# Altium schematic sheet psu.SchDoc: Power Supplies
size A2; DrawnBy: Stefan Lippuner; Organization: TIK; DocumentNumber: 3; Revision: 1; SheetNumber: 3; SheetTotal: 8
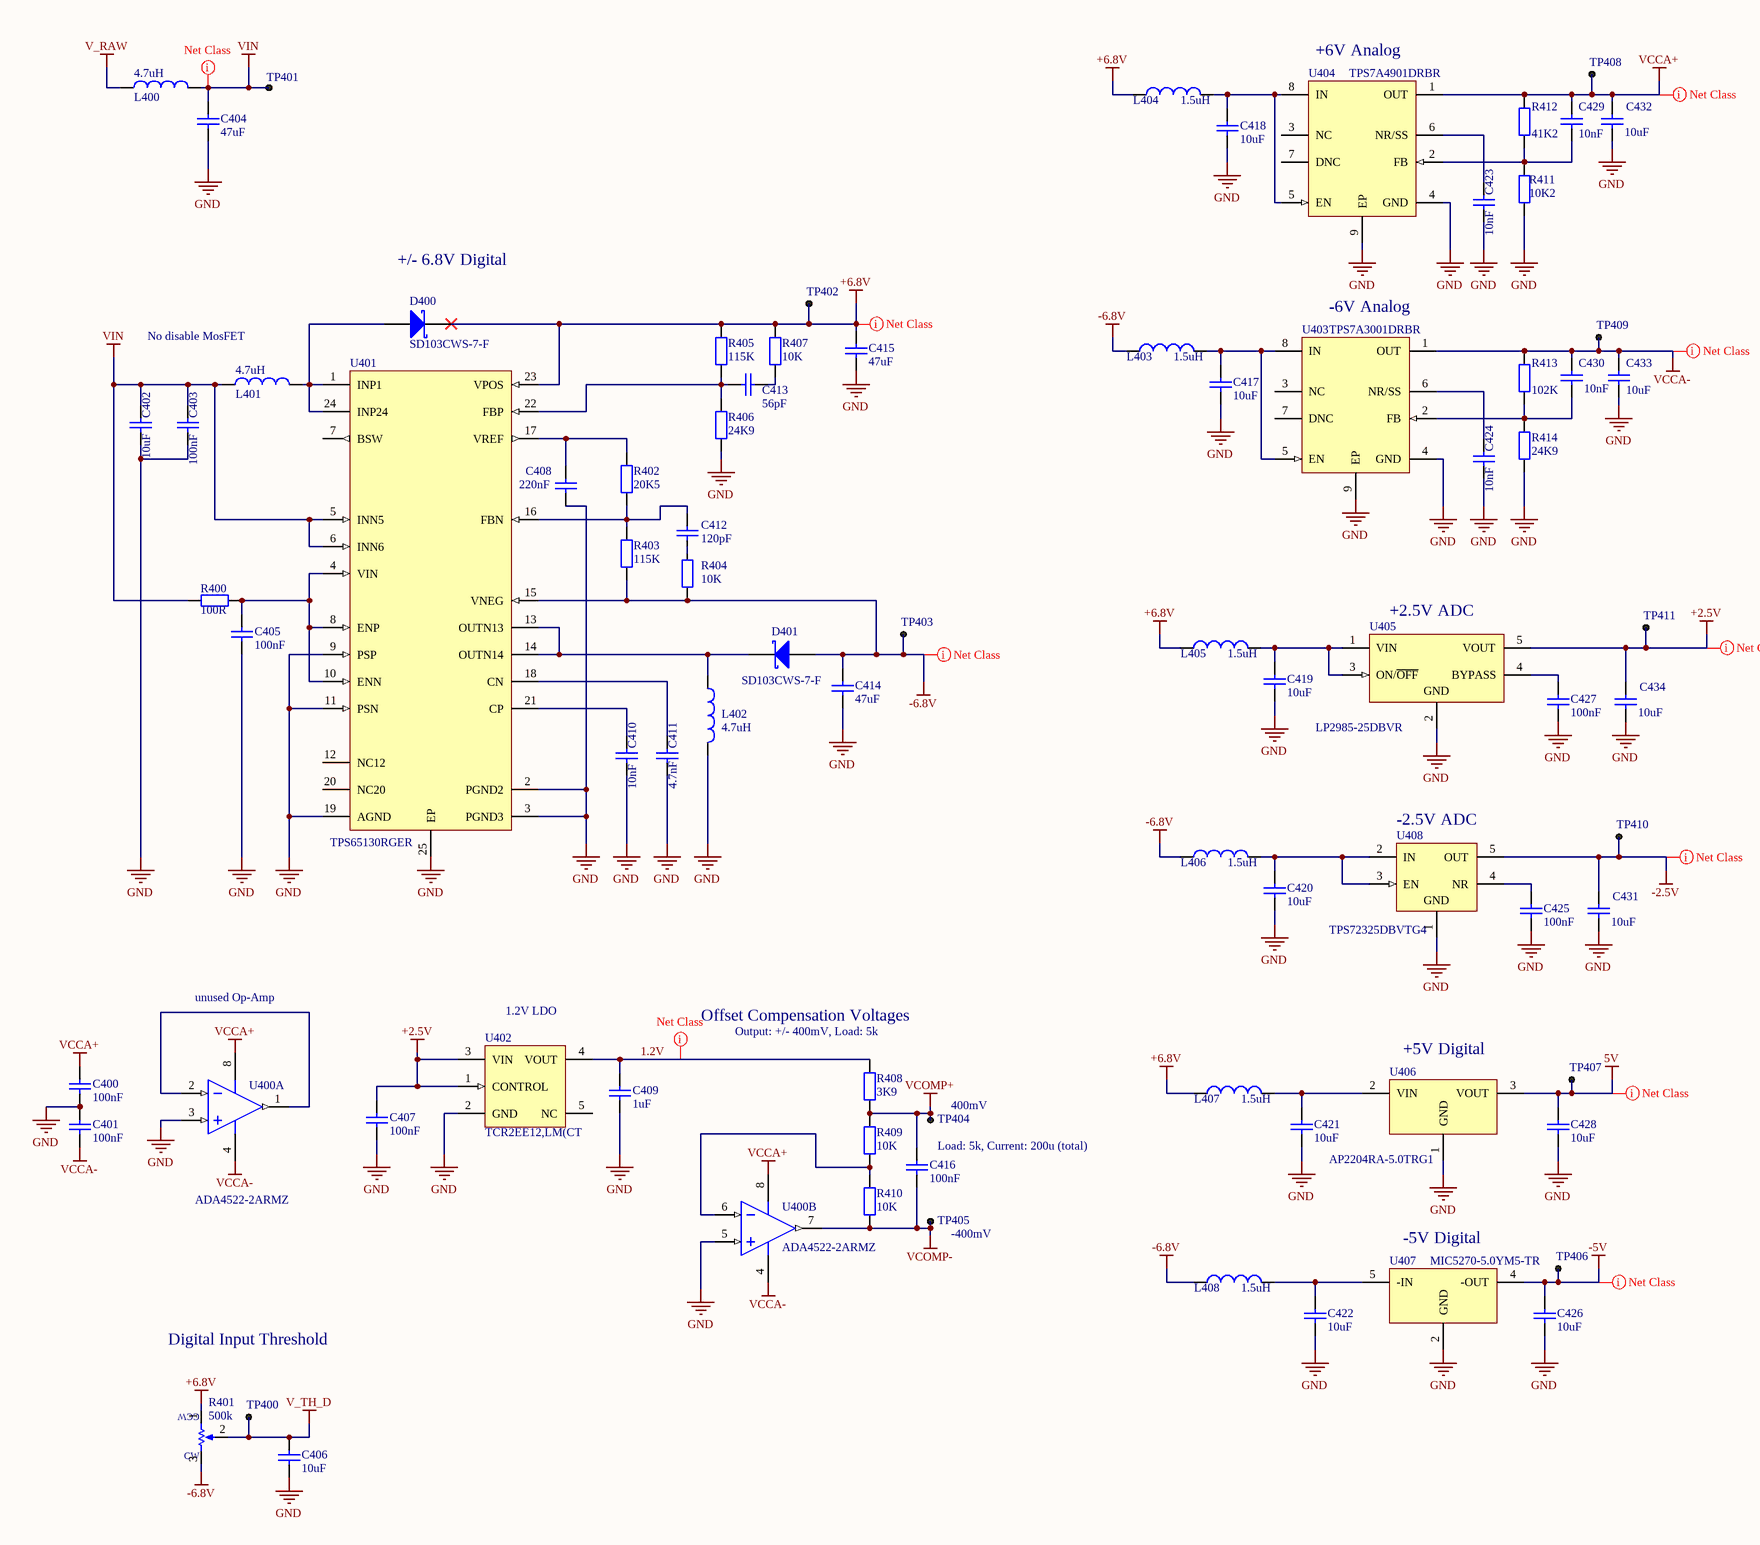
[diagram p0: psu.SchDoc]

## Parts
C400  100nF  [CAPC0402(1005)60_L]
C401  100nF  [CAPC0402(1005)60_L]
C402  10uF  [CAPC0603(1608)100_L]
C403  100nF  [CAPC0402(1005)60_L]
C404  47uF  [CAPC1210(3225)280_L]
C405  100nF  [CAPC0402(1005)60_L]
C406  10uF  [CAPC0603(1608)100_L]
C407  100nF  [CAPC0402(1005)60_L]
C408  220nF  [CAPC0402(1005)60_L]
C409  1uF  [CAPC0402(1005)60_L]
C410  10nF  [CAPC0402(1005)60_L]
C411  4.7nF  [CAPC0402(1005)60_L]
C412  120pF  [CAPC0402(1005)60_L]
C413  56pF  [CAPC0402(1005)60_L]
C414  47uF  [CAPC1210(3225)280_L]
C415  47uF  [CAPC1210(3225)280_L]
C416  100nF  [CAPC0402(1005)60_L]
C417  10uF  [CAPC0603(1608)100_L]
C418  10uF  [CAPC0603(1608)100_L]
C419  10uF  [CAPC0603(1608)100_L]
C420  10uF  [CAPC0603(1608)100_L]
C421  10uF  [CAPC0603(1608)100_L]
C422  10uF  [CAPC0603(1608)100_L]
C423  10nF  [CAPC0402(1005)60_L]
C424  10nF  [CAPC0402(1005)60_L]
C425  100nF  [CAPC0402(1005)60_L]
C426  10uF  [CAPC0603(1608)100_L]
C427  100nF  [CAPC0402(1005)60_L]
C428  10uF  [CAPC0603(1608)100_L]
C429  10nF  [CAPC0402(1005)60_L]
C430  10nF  [CAPC0402(1005)60_L]
C431  10uF  [CAPC0603(1608)100_L]
C432  10uF  [CAPC0603(1608)100_L]
C433  10uF  [CAPC0603(1608)100_L]
C434  10uF  [CAPC0603(1608)100_L]
D400  SD103CWS-7-F  [DIOD-SOD323-2_V]
D401  SD103CWS-7-F  [DIOD-SOD323-2_V]
L400  4.7uH  [INDC2520X10L]
L401  4.7uH  [INDC2520X10L]
L402  4.7uH  [INDC2520X10L]
L403  1.5uH  [INDC0603(1608)_L]
L404  1.5uH  [INDC0603(1608)_L]
L405  1.5uH  [INDC0603(1608)_L]
L406  1.5uH  [INDC0603(1608)_L]
L407  1.5uH  [INDC0603(1608)_L]
L408  1.5uH  [INDC0603(1608)_L]
R400  100R  [RESC0402(1005)_L]
R401  value 500k  [43W]  (hidden comment: 43WR500KLFTR)
R402  20K5  [RESC0402(1005)_L]
R403  115K  [RESC0402(1005)_L]
R404  10K  [RESC0402(1005)_L]
R405  115K  [RESC0402(1005)_L]
R406  24K9  [RESC0402(1005)_L]
R407  10K  [RESC0402(1005)_L]
R408  3K9  [RESC0402(1005)_L]
R409  10K  [RESC0402(1005)_L]
R410  10K  [RESC0402(1005)_L]
R411  10K2  [RESC0402(1005)_L]
R412  41K2  [RESC0402(1005)_L]
R413  102K  [RESC0402(1005)_L]
R414  24K9  [RESC0402(1005)_L]
TP400  (no value)  [Pad-0.6mm]  (no BOM)
TP401  (no value)  [Pad-0.6mm]  (no BOM)
TP402  (no value)  [Pad-0.6mm]  (no BOM)
TP403  (no value)  [Pad-0.6mm]  (no BOM)
TP404  (no value)  [Pad-0.6mm]  (no BOM)
TP405  (no value)  [Pad-0.6mm]  (no BOM)
TP406  (no value)  [Pad-0.6mm]  (no BOM)
TP407  (no value)  [Pad-0.6mm]  (no BOM)
TP408  (no value)  [Pad-0.6mm]  (no BOM)
TP409  (no value)  [Pad-0.6mm]  (no BOM)
TP410  (no value)  [Pad-0.6mm]  (no BOM)
TP411  (no value)  [Pad-0.6mm]  (no BOM)
U400  ADA4522-2ARMZ  [ADI-RM-8_L]  (parts A,B of 2)
U401  TPS65130RGER  [LT-UF-24_L]
U402  TCR2EE12,LM(CT  [TI-DRL5_L]
U403  TPS7A3001DRBR  [DRB8-1750X1500TP]
U404  TPS7A4901DRBR  [DRB8-1750X1500TP]
U405  LP2985-25DBVR  [DBV0005A_L]
U406  AP2204RA-5.0TRG1  [SOT89_L]
U407  MIC5270-5.0YM5-TR  [Z5+1_L]
U408  TPS72325DBVTG4  [TI-DBV5_L]

## Nets
5V: C428.2 TP407.1 U406.3(VOUT)
+2.5V: C407.2 C434.2 TP411.1 U402.1(CONTROL) U402.3(VIN) U405.5(VOUT)
+6.8V: C415.1 D400.2(K) L404.1 L405.1 L407.1 R401.1(CCW) R405.2 R407.2 TP402.1 U401.23(VPOS)
-2.5V: C431.2 TP410.1 U408.5(OUT)
-5V: C426.2 TP406.1 U407.4(-OUT)
-6.8V: C414.1 D401.1(A) L403.1 L406.1 L408.1 R401.3(CW) R403.2 R404.1 TP403.1 U401.15(VNEG)
GND: C400.1 C401.2 C402.1 C403.1 C404.2 C405.1 C406.1 C407.1 C408.1 C409.1 C410.1 C411.1 C414.2 C415.2 C417.1 C418.1 C419.1 C420.1 C421.1 C422.1 C423.1 C424.1 C425.1 C426.1 C427.1 C428.1 C431.1 C432.1 C433.1 C434.1 L402.2 R406.1 R411.1 R414.1 U400.3(1IN+) U400.5(2IN+) U401.2(PGND2) U401.3(PGND3) U401.9(PSP) U401.11(PSN) U401.19(AGND) U401.25(EP) U402.2(GND) U403.4(GND) U403.9(EP) U404.4(GND) U404.9(EP) U405.2(GND) U406.1(GND) U407.2(GND) U408.1(GND)
V_RAW: L400.1
V_TH_D: C406.2 R401.2(WIPER) TP400.1
VCCA+: C400.2 C429.2 C432.2 R412.2 TP408.1 U400.8(V+) U404.1(OUT)
VCCA-: C401.1 C430.2 C433.2 R413.2 TP409.1 U400.4(V-) U403.1(OUT)
VCOMP+: C416.2 R408.1 R409.2 TP404.1
VCOMP-: C416.1 R410.1 TP405.1 U400.7(2OUT)
VIN: C402.2 C403.2 C404.1 L400.2 L401.1 R400.2 TP401.1 U401.5(INN5) U401.6(INN6)
1.2V: C409.2 R408.2 U402.4(VOUT)
NetC405_2: C405.2 R400.1 U401.4(VIN) U401.8(ENP) U401.10(ENN)
NetC408_2: C408.2 R402.2 U401.17(VREF)
NetC410_2: C410.2 U401.21(CP)
NetC411_2: C411.2 U401.18(CN)
NetC412_1: C412.1 R404.2
NetC412_2: C412.2 R402.1 R403.1 U401.16(FBN)
NetC413_1: C413.1 R407.1
NetC413_2: C413.2 R405.1 R406.2 U401.22(FBP)
NetC417_2: C417.2 L403.2 U403.5(EN) U403.8(IN)
NetC418_2: C418.2 L404.2 U404.5(EN) U404.8(IN)
NetC419_2: C419.2 L405.2 U405.1(VIN) U405.3(ON/~{OFF})
NetC420_2: C420.2 L406.2 U408.2(IN) U408.3(EN)
NetC421_2: C421.2 L407.2 U406.2(VIN)
NetC422_2: C422.2 L408.2 U407.5(-IN)
NetC423_2: C423.2 U404.6(NR/SS)
NetC424_2: C424.2 U403.6(NR/SS)
NetC425_2: C425.2 U408.4(NR)
NetC427_2: C427.2 U405.4(BYPASS)
NetC429_1: C429.1 R411.2 R412.1 U404.2(FB)
NetC430_1: C430.1 R413.1 R414.2 U403.2(FB)
NetD400_1: D400.1(A) L401.2 U401.1(INP1) U401.24(INP24)
NetD401_2: D401.2(K) L402.1 U401.13(OUTN13) U401.14(OUTN14)
NetR409_1: R409.1 R410.2 U400.6(2IN-)
NetU400_1: U400.1(1OUT) U400.2(1IN-)

Not connected (* = marked no-connect by the designer): U401 7(BSW) 12(NC12) 20(NC20); U402 5(NC); U403 3(NC) 7(DNC); U404 3(NC) 7(DNC)

## Layout directives
net class Power: 1.2V, 5V, +2.5V, +6.8V, -2.5V, -5V, -6.8V, VCCA+, VCCA-, VIN

## Notes on the sheet
- (near U404) +6V Analog
- +/- 6.8V Digital
- (near L401) No disable MosFET
- (near U403) -6V Analog
- (near U405) +2.5V ADC
- (near U408) -2.5V ADC
- unused Op-Amp
- (near U402) 1.2V LDO
- (near R408) Offset Compensation Voltages
- (near R408) Output: +/- 400mV, Load: 5k
- (near U406) +5V Digital
- Load: 5k, Current: 200u (total)
- (near TP404) 400mV
- (near TP405) -400mV
- (near U407) -5V Digital
- Digital Input Threshold
- 1
- 2
- 3
- 4
- 5
- 6
- 7
- 8
- A
- B
- C
- D
- Project:
- Drawing number:
- Rev:
- Format:
- Laboratory:
- Sheet:
- File:
- Date:
- A2
- Drawn by:
- Page
- of

## Library data of the parts
C400 C401 C403 C405 C407 C416 C425 C427 = CMP-1034-02071-1: CAP 100nF 16V -20% to +80% 0402 (1005 Metric) Thickness 0.6mm SMD; Case-Metric: 1005; Case-EIA: 0402; Value: 100nF; Rated Voltage: 16 V; Tolerance: -20% to +80%; Technology: SMT; Max Thickness: 0.6 mm
C402 C406 C417-C422 C426 C428 C431-C434 = CMP-1035-02800-1: CAP 10uF 10V ±20% 0603 (1608 Metric) Thickness 1mm SMD; Tolerance: Â±20%; Case-EIA: 0603; Case-Metric: 1608; Max Thickness: 1 mm; Rated Voltage: 10 V; Technology: SMT; Value: 10uF
C404 C414 C415 = CMP-1038-02296-1: CAP 47uF 16V ±20% 1210 (3225 Metric) Thickness 2.8mm SMD; Case-EIA: 1210; Case-Metric: 3225; Tolerance: Â±20%; Value: 47uF; Technology: SMT; Max Thickness: 2.8 mm; Rated Voltage: 16 V
C408 = CMP-1034-02088-1: CAP 220nF 10V -20% to +80% 0402 (1005 Metric) Thickness 0.6mm SMD; Case-Metric: 1005; Case-EIA: 0402; Value: 220nF; Rated Voltage: 10 V; Technology: SMT; Max Thickness: 0.6 mm; Tolerance: -20% to +80%
C409 = CMP-1034-02120-1: CAP 1uF 16V ±20% 0402 (1005 Metric) Thickness 0.6mm SMD; Tolerance: Â±20%; Case-EIA: 0402; Case-Metric: 1005; Rated Voltage: 16 V; Value: 1uF; Technology: SMT; Max Thickness: 0.6 mm
C410 = CMP-1034-01879-1: CAP 10nF 25V ±5% 0402 (1005 Metric) Thickness 0.6mm SMDC; Case-EIA: 0402; Tolerance: Â±5%; Case-Metric: 1005; Value: 10nF; Max Thickness: 0.6 mm; Rated Voltage: 25 V; Technology: SMT
C411 = CMP-1034-01819-1: CAP 4.7nF 100V ±10% 0402 (1005 Metric) Thickness 0.6mm SMD; Tolerance: Â±10%; Case-Metric: 1005; Case-EIA: 0402; Max Thickness: 0.6 mm; Rated Voltage: 100 V; Value: 4.7nF; Technology: SMT
C412 = CMP-1034-01278-1: CAP 120pF 100V ±1% 0402 (1005 Metric) Thickness 0.6mm SMD; Case-EIA: 0402; Tolerance: Â±1%; Case-Metric: 1005; Technology: SMT; Value: 120pF; Max Thickness: 0.6 mm; Rated Voltage: 100 V
C413 = CMP-1034-01134-1: CAP 56pF 100V ±1% 0402 (1005 Metric) Thickness 0.6mm SMD; Tolerance: Â±1%; Case-Metric: 1005; Case-EIA: 0402; Rated Voltage: 100 V; Max Thickness: 0.6 mm; Technology: SMT; Value: 56pF
C423 C424 C429 C430 = CMP-1034-01879-1: CAP 10nF 25V ±5% 0402 (1005 Metric) Thickness 0.6mm SMDC; Case-EIA: 0402; Case-Metric: 1005; Tolerance: Â±5%; Max Thickness: 0.6 mm; Value: 10nF; Technology: SMT; Rated Voltage: 25 V
D400 D401 = CMP-00120-1: DIODE SCHOTTKY 20V 350MA SOD323; Manufacturer: Diodes Incorporated; Current - Average Rectified (Io): 350mA (DC); Voltage - Forward (Vf) (Max) @ If: 600mV @ 200mA; Speed: Fast Recovery =< 500ns, > 200mA (Io); Reverse Recovery Time (trr): 10ns; Current - Reverse Leakage @ Vr: 5µA @ 10V; Capacitance @ Vr, F: 28pF @ 0V, 1MHz; Packaging: Tape & Reel (TR); Diode Type: Schottky; Voltage - DC Reverse (Vr) (Max): 20V; Mounting Type: Surface Mount; Package / Case: SC-76, SOD-323; Supplier Device Package: SOD-323; Operating Temperature - Junction: -65°C ~ 125°C; P/N: SD103CWS-7-F; Supplier: Digi-Key; Supplier Part Number: SD103CWS-FDITR-ND; ComponentLink1Description: ds30101.pdf; ComponentLink1URL: http://www.diodes.com/_files/datasheets/ds30101.pdf
L400-L402 = CMP-00119-1: FIXED IND 4.7UH 1A 110 MOHM SMD; Manufacturer: TDK Corporation; Type: Multilayer; Material - Core: Ferrite; Inductance: 4.7µH; Tolerance: ±20%; Shielding: Shielded; DC Resistance (DCR): 143 mOhm Max; Frequency - Test: 2MHz; P/N: MLP2520S4R7ST0S1; Packaging: Tape & Reel (TR); Current Rating: 1A; Current - Saturation: -; Q @ Freq: -; Frequency - Self Resonant: -; Ratings: -; Operating Temperature: -40°C ~ 125°C; Mounting Type: Surface Mount; Package / Case: 1008 (2520 Metric); Size / Dimension: 0.098" L x 0.079" W (2.50mm x 2.00mm); Height - Seated (Max): 0.039" (1.00mm); Supplier: Digi-Key; Supplier Part Number: 445-6378-2-ND; ComponentLink1Description: inductor_commercial_power_mlp2520_en.pdf; ComponentLink1URL: https://product.tdk.com/info/en/catalog/datasheets/inductor_commercial_power_mlp2520_en.pdf
L403-L408 = CMP-00229-1: FIXED IND 1.5UH 50MA 700 MOHM; Manufacturer: TDK Corporation; Manufacturer Part Number: MLF1608A1R5M; Type: Multilayer; Material - Core: Ferrite; Inductance: 1.5µH; Tolerance: ±20%; Shielding: Shielded; DC Resistance (DCR): 700 mOhm Max; Q @ Freq: 35 @ 10MHz; Frequency - Self Resonant: 100MHz; Frequency - Test: 10MHz; Packaging: Cut Tape (CT); Part Status: Active; Current Rating: 50mA; Current - Saturation: -; Ratings: -; Operating Temperature: -40°C ~ 85°C; Mounting Type: Surface Mount; Package / Case: 0603 (1608 Metric); Size / Dimension: 0.063" L x 0.031" W (1.60mm x 0.80mm); Height - Seated (Max): 0.037" (0.95mm); Supplier: Digi-Key; Supplier Part Number: 445-6221-1-ND; ComponentLink1Description: inductor_commercial_standard_mlf1608_en.pdf; ComponentLink1URL: https://product.tdk.com/info/en/catalog/datasheets/inductor_commercial_standard_mlf1608_en.pdf
R400 = CMP-1011-00397-1: 100R 0.063W 1% 0402 (1005 Metric)  SMD; Case-EIA: 0402; Case-Metric: 1005; Value: 100.00 Ohm; Technology: SMT; Tolerance: 1 %; Power: 0.063 W
R401 = CMP-00227-2: TRIMMER 500K OHM 0.125W SMD; Manufacturer: TT Electronics/BI; Power (Watts): 0.125W, 1/8W; Tolerance: ±20%; Temperature Coefficient: ±100ppm/°C; Number of Turns: 11; Adjustment Type: Top Adjustment; Resistive Material: Cermet; Packaging: Digi-Reel®; Part Status: Active; Resistance (Ohms): 500k; Mounting Type: Surface Mount; Termination Style: J Lead; Size / Dimension: Rectangular - 0.161" x 0.125" Face x 0.161" H (4.10mm x 3.18mm x 4.10mm); Manufacturer Part Number: 43WR500KLFTR; Supplier: Digi-Key; Supplier Part Number: 987-1040-6-ND; ComponentLink1Description: 43.pdf; ComponentLink1URL: http://www.bitechnologies.com/pdfs/43.pdf
R402 = CMP-1011-00656-1: 20K5 0.063W 1% 0402 (1005 Metric)  SMD; Case-Metric: 1005; Value: 20500.00 Ohm; Case-EIA: 0402; Power: 0.063 W; Technology: SMT; Tolerance: 1 %
R403 R405 = CMP-1011-00742-1: 115K 0.063W 1% 0402 (1005 Metric)  SMD; Case-Metric: 1005; Value: 115000.00 Ohm; Case-EIA: 0402; Tolerance: 1 %; Technology: SMT; Power: 0.063 W
R404 R407 R409 R410 = CMP-1011-00623-1: 10K 0.063W 1% 0402 (1005 Metric)  SMD; Case-Metric: 1005; Value: 10000.00 Ohm; Case-EIA: 0402; Tolerance: 1 %; Technology: SMT; Power: 0.063 W
R406 R414 = CMP-1011-00666-1: 24K9 0.063W 1% 0402 (1005 Metric)  SMD; Value: 24900.00 Ohm; Case-Metric: 1005; Case-EIA: 0402; Tolerance: 1 %; Technology: SMT; Power: 0.063 W
R408 = CMP-1011-00576-1: 3K9 0.063W 1% 0402 (1005 Metric)  SMD; Case-EIA: 0402; Value: 3900.00 Ohm; Case-Metric: 1005; Tolerance: 1 %; Power: 0.063 W; Technology: SMT
R411 = CMP-1011-00624-1: 10K2 0.063W 1% 0402 (1005 Metric)  SMD; Value: 10200.00 Ohm; Case-EIA: 0402; Case-Metric: 1005; Technology: SMT; Power: 0.063 W; Tolerance: 1 %
R412 = CMP-1011-00692-1: 41K2 0.063W 1% 0402 (1005 Metric)  SMD; Value: 41200.00 Ohm; Case-Metric: 1005; Case-EIA: 0402; Technology: SMT; Tolerance: 1 %; Power: 0.063 W
R413 = CMP-1011-00737-1: 102K 0.063W 1% 0402 (1005 Metric)  SMD; Value: 102000.00 Ohm; Case-Metric: 1005; Case-EIA: 0402; Technology: SMT; Tolerance: 1 %; Power: 0.063 W
TP400-TP411 = CMP-00224-1: 0.6mm SMT Test Pad; Mounting Technology: SMT
U400 = CMP-00103-1: SP Amp Zero Drift Amplifier Dual R-R I/O ±27.5V/55V 8-Pin MSOP; Manufacturer: Analog Devices Inc.; Amplifier Type: Zero-Drift; Output Type: Rail-to-Rail; Slew Rate: 1.7 V/µs; Gain Bandwidth Product: 2.7MHz; Current - Input Bias: 50pA; Voltage - Input Offset: 1.5µV; Current - Supply: 830µA; Current - Output / Channel: 32mA; Voltage - Supply, Single/Dual (±): 4.5 V ~ 55 V, ±2.25 V ~ 27.5 V; Packaging: Tube; Number of Circuits: -; -3db Bandwidth: -; Operating Temperature: -40°C ~ 125°C; Mounting Type: Surface Mount; Package / Case: 8-TSSOP, 8-MSOP (0.118", 3.00mm Width); Supplier Device Package: 8-MSOP; Manufacturer Part Number: ADA4522-2ARMZ; Supplier: Digi-Key; Supplier Part Number: ADA4522-2ARMZ-ND; ComponentLink1Description: ADA4522-1_4522-2_4522-4.pdf; ComponentLink1URL: http://www.analog.com/media/en/technical-documentation/data-sheets/ADA4522-1_4522-2_4522-4.pdf
U401 = CMP-00108-2: Conv DC-DC Dual Inv/Step Up 2.7V to 5.5V 24-Pin VQFN EP; Manufacturer: Texas Instruments; Function: Step-Up, Step-Up/Step-Down; Output Configuration: Positive and Negative (Dual Rail); Topology: Boost, Buck-Boost; Output Type: Adjustable; Number of Outputs: 2; Voltage - Output (Min/Fixed): 3.2V, -2V; Voltage - Output (Max): 15V, -15V; Current - Output: 700mA (Switch); Frequency - Switching: 1.38MHz; Synchronous Rectifier: No; Packaging: Cut Tape (CT); Voltage - Input (Min): 2.7V; Voltage - Input (Max): 5.5V; Operating Temperature: -40°C ~ 85°C (TA); Mounting Type: Surface Mount; Package / Case: 24-VFQFN Exposed Pad; Supplier Device Package: 24-VQFN (4x4); P/N: TPS65130RGER; Supplier: Digi-Key; Supplier Part Number: 296-17080-1-ND; ComponentLink1Description: tps65130.pdf; ComponentLink1URL: http://www.ti.com/lit/ds/symlink/tps65130.pdf
U402 = CMP-00117-2: IC REG LDO 1.2V 0.2A ESV; Manufacturer: Toshiba Semiconductor and Storage; Regulator Topology: Positive Fixed; Current - Output: 200mA; Voltage - Dropout (Typical): 0.38V @ 150mA; Number of Regulators: 1; Voltage - Input: Up to 5.5V; Packaging: Tape & Reel (TR); Voltage - Output: 1.2V; Current - Limit (Min): -; Operating Temperature: -40°C ~ 85°C; Mounting Type: Surface Mount; Package / Case: SOT-553; Supplier Device Package: ESV; P/N: TCR2EE12,LM(CT; Supplier: Digi-Key; Supplier Part Number: TCR2EE12LM(CTTR-ND; ComponentLink1Description: docget.jsp?pid=TCR2EE10&lang=en&type=datasheet; ComponentLink1URL: http://www.semicon.toshiba.co.jp/info/docget.jsp?pid=TCR2EE10&lang=en&type=datasheet
U403 = CMP-00109-1: LDO Voltage Regulators Vin -3V to -36V, -200mA, Ultra-Low Noise, High PSRR, Low-Dropout Linear Regulator 8-SON; Manufacturer: Texas Instruments; Regulator Topology: Negative Adjustable; Voltage - Output: -1.18 V ~ -33 V; Current - Output: 200mA; Voltage - Dropout (Typical): 0.325V @ 200mA; Number of Regulators: 1; Voltage - Input: -3 V ~ -35 V; Current - Limit (Min): 220mA; Packaging: Tape & Reel (TR); Operating Temperature: -40°C ~ 125°C; Mounting Type: Surface Mount; Package / Case: 8-VFDFN Exposed Pad; Supplier Device Package: 8-SON (3x3); P/N: TPS7A3001DRBR; Supplier: Digi-Key; Supplier Part Number: 296-42394-2-ND; ComponentLink1Description: tps7a30.pdf; ComponentLink1URL: http://www.ti.com/lit/ds/symlink/tps7a30.pdf
U404 = CMP-00110-1: LDO Voltage Regulators Vin 3V to 36V, 150mA, Ultra-Low Noise, High PSRR, Low-Dropout Linear Regulator 8-SON; Manufacturer: Texas Instruments; Regulator Topology: Positive Adjustable; Voltage - Output: 1.194 V ~ 33 V; Voltage - Dropout (Typical): 0.333V @ 150mA; Number of Regulators: 1; Voltage - Input: 3 V ~ 35 V; Current - Limit (Min): 220mA; ComponentLink1Description: tps7a49.pdf; ComponentLink1URL: http://www.ti.com/lit/ds/symlink/tps7a49.pdf; Packaging: Cut Tape (CT); Current - Output: 150mA; Operating Temperature: -40°C ~ 125°C; Mounting Type: Surface Mount; Package / Case: 8-VDFN Exposed Pad; Supplier Device Package: 8-SON (3x3); P/N: TPS7A4901DRBR; Supplier: Digi-Key; Supplier Part Number: 296-42154-1-ND
U405 = CMP-0758-00027-2: Single Output Low Noise LDO, 150 mA, Fixed 2.5 V Output, 1.5% Tolerance, 2.2 to 16 V Input, Low IQ, 5-Pin SOT-23 (DBV), -40 to 125 degC, Green (RoHS & no Sb/Br), Tape and Reel; Manufacturer: Texas Instruments; Fixed Output Options (V): 2.5; Accuracy (%): 1.5; Vdo (Typ) (mV): 280; Iout (Max) (A): 0.15; Output Options: Fixed Output; Iq (Typ) (mA): 0.85; ComponentLink3Description: Package Specification; RoHS: TRUE; DatasheetVersion: SLVS522N; ComponentLink1Description: Manufacturer URL; Operating Temperature Range (degC): -40 to 125; Packing: Tape and Reel; PackageReference: DBV0005A; ComponentLink3URL: http://www.ti.com/litv/pdf/mpds018j; ComponentLink2Description: Datasheet; Vin (V): 2.2 to 16; PackageVersion: 4073253-4/L; PackageDescription: 5-Pin Plastic Small Outline, Body 2.9 x 1.6 mm, Pitch 0.95 mm; ComponentLink1URL: http://www.ti.com/; ComponentLink2URL: http://www.ti.com/lit/ds/symlink/lp2985-50.pdf; PartNumber: LP2985-25DBVR; Mounting Technology: Surface Mount
U406 = CMP-00226-1: IC REG LDO Linear Voltage Regulator Positive Fixed 1 Output 5V 150mA SOT-89-3; Manufacturer: Diodes Incorporated; Voltage - Dropout (Typical): 0.36V @ 150mA; Number of Regulators: 1; Voltage - Input: Up to 24V; Packaging: Cut Tape (CT); Part Status: Active; Regulator Topology: Positive Fixed; Voltage - Output: 5V; Current - Output: 150mA; Current - Limit (Min): -; Operating Temperature: -40°C ~ 85°C; Mounting Type: Surface Mount; Package / Case: TO-243AA; Supplier Device Package: SOT-89-3; Manufacturer Part Number: AP2204RA-5.0TRG1; Supplier: Digi-Key; Supplier Part Number: AP2204RA-5.0TRG1DICT-ND; ComponentLink1Description: AP2204.pdf; ComponentLink1URL: http://www.diodes.com/_files/datasheets/AP2204.pdf
U407 = CMP-00219-1: IC REG LDO Linear Voltage Regulator Negative Fixed 1 Output -5V 100mA SOT-23-5; Manufacturer: Microchip Technology; Voltage - Dropout (Typical): 0.5V @ 100mA; Number of Regulators: 1; Voltage - Input: Down to -16V; Packaging: Cut Tape (CT); Part Status: Active; Regulator Topology: Negative Fixed; Voltage - Output: -5V; Current - Output: 100mA; Current - Limit (Min): -; Operating Temperature: -40°C ~ 125°C; Mounting Type: Surface Mount; Package / Case: SC-74A, SOT-753; Supplier Device Package: SOT-23-5; Manufacturer Part Number: MIC5270-5.0YM5-TR; Supplier: Digi-Key; Supplier Part Number: 576-1294-1-ND; ComponentLink1Description: filehandler.aspx?ddocname=en579863; ComponentLink1URL: http://www.microchip.com/mymicrochip/filehandler.aspx?ddocname=en579863
U408 = CMP-0394-00283-1: Single Output High PSRR LDO, 200 mA, Fixed -2.5 V Output, -10 to -2.7 V Input, 5-pin SOT-23 (DBV), -40 to 125 degC, Green (RoHS & no Sb/Br); Manufacturer: Texas Instruments; Vdo(Typ)(mV): 280; Accuracy(%): 2; SubFamily: Single Channel LDO; Iq(Typ)(mA): 0.13; Iout(Max)(A): 0.2; ComponentLink3Description: Package Specification; PartNumber: TPS72325DBVTG4; Mounting Technology: Surface Mount; Vout Adj(Max)(V): -2.5; DatasheetVersion: SLVS346B; Eco-Plan: Green (RoHS & no Sb/Br); Fixed Output Options(V): -2.5; ComponentLink2Description: Datasheet; ComponentLink1URL: http://www.ti.com/; PackageDescription: 5-Pin Plastic Small Outline, Body 1.60 Ãƒâ€” 2.90 mm, Pitch 0.95 mm; ComponentLink1Description: Manufacturer URL; ComponentLink2URL: http://www.ti.com/general/docs/lit/getliterature.tsp?genericPartNumber=TPS72325&fileType=pdf; Code_JEDEC: MO-178; Vin(Max)(V): -2.7; PackageVersion: 4073253-4/K; Vout Adj(Min)(V): -2.5; ComponentLink3URL: http://www.ti.com/litv/pdf/mpds018i; PackageReference: DBV5; Vin(Min)(V): -10